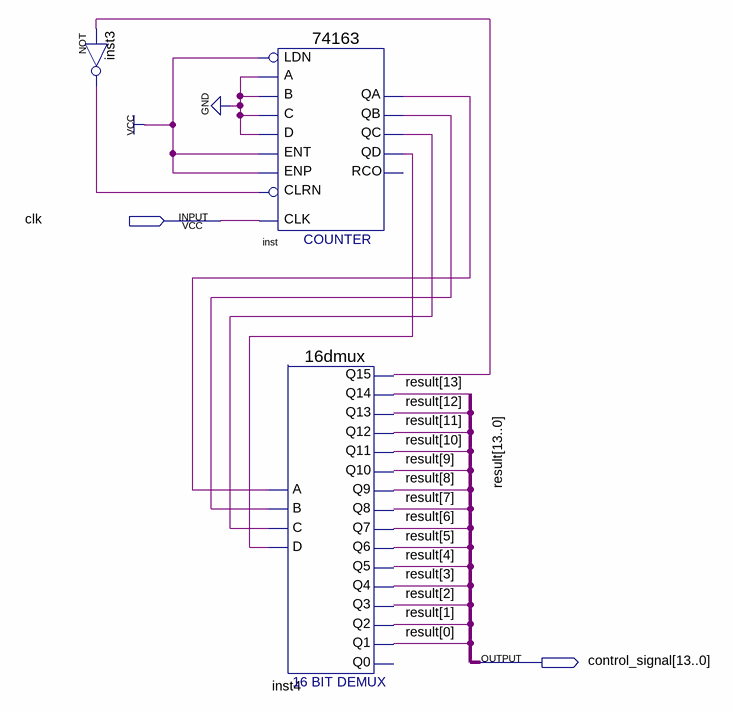
[diagram p0: schematic sheet]
// Quartus schematic DistributorBlock.bdf as structural Verilog: 3 symbols, 2 pins
module DistributorBlock (
  input  clk,
  output [13:0] control_signal
);

  wire inst3_out, inst4_q15, inst_qa, inst_qb, inst_qc, inst_qd;

  not inst3 (inst3_out, inst4_q15);
  \74163  inst (
    .C(1'b0), .B(1'b0), .A(1'b0), .ENT(1'b1), .D(1'b0), .CLRN(inst3_out), .CLK(clk), .ENP(1'b1), .LDN(1'b1),
    .QA(inst_qa), .QB(inst_qb), .QC(inst_qc), .QD(inst_qd));  // open: RCO
  \16dmux  inst4 (
    .C(inst_qc), .B(inst_qb), .A(inst_qa), .D(inst_qd), .Q12(control_signal[11]), .Q13(control_signal[12]),
    .Q11(control_signal[10]), .Q9(control_signal[8]), .Q10(control_signal[9]), .Q7(control_signal[6]),
    .Q8(control_signal[7]), .Q4(control_signal[3]), .Q5(control_signal[4]), .Q6(control_signal[5]),
    .Q2(control_signal[1]), .Q3(control_signal[2]), .Q14(control_signal[13]), .Q15(inst4_q15),
    .Q1(control_signal[0]));  // open: Q0

  // Other names for the same wires on the sheet: result[13:0] = control_signal
endmodule
